# Altium schematic sheet РЕУН.468323.001_Encoder.SchDoc: =Name-1str
size 420 x 297 mm; SheetNumber: 4; Вид изделия: Документация; Раздел: Документация; Код документа: Э3; Вид документа: Схема электрическая принципиальная; Класс документа: Конструкторский документ; Создавать изделие в PLM: Yes; DocumentCode: РЕУН.468323.001 Э3 2D; DocumentView: Схема электрическая принципиальная; DocumentClass: Конструкторский документ; ProductView: Документация; Format: А3
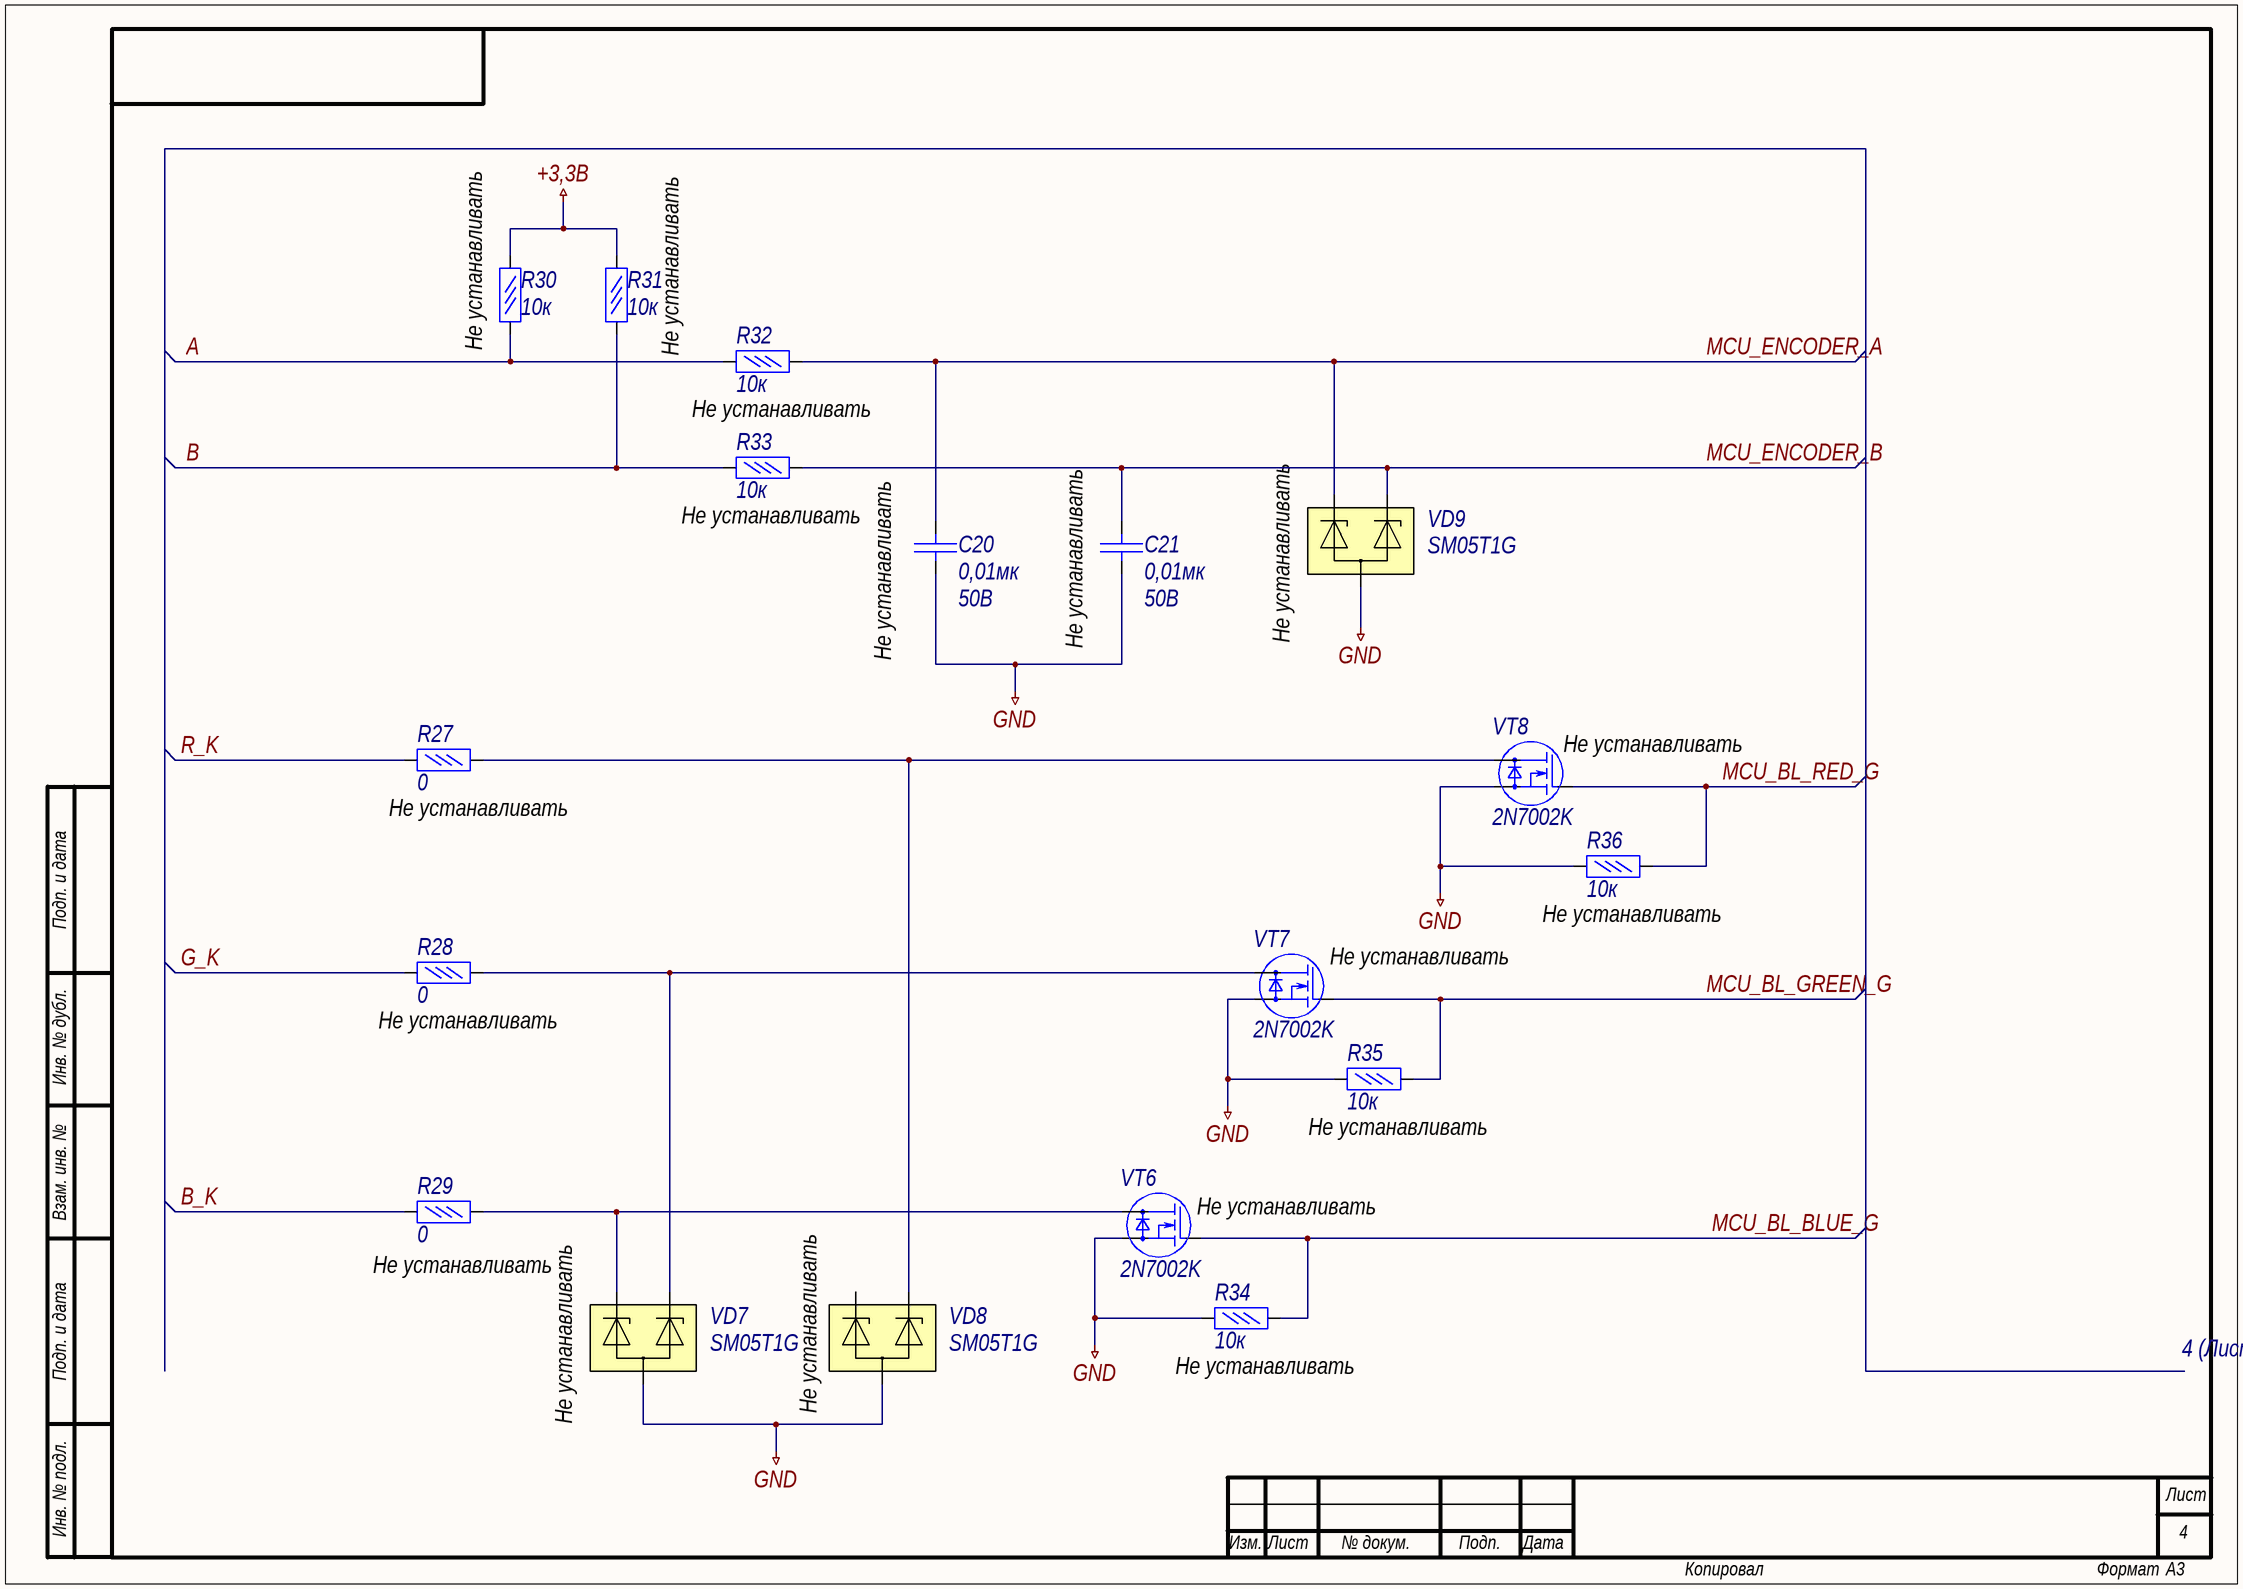
[diagram p0: РЕУН.468323.001_Encoder.SchDoc]

## Parts
C20  Voltage: 50В  [C0805_AA]  (hidden comment: 0,01мк)
C21  Voltage: 50В  [C0805_AA]  (hidden comment: 0,01мк)
R27  0  [R1206]
R28  0  [R1206]
R29  0  [R1206]
R30  10к  [R1206]
R31  10к  [R1206]
R32  10к  [R1206]
R33  10к  [R1206]
R34  10к  [R1206]
R35  10к  [R1206]
R36  10к  [R1206]
VD7  SM05T1G
VD8  SM05T1G
VD9  SM05T1G
VT6  2N7002K  [SOT23-3]
VT7  2N7002K  [SOT23-3]
VT8  2N7002K  [SOT23-3]

## Nets
+3,3В: R30.2 R31.2
GND: C20.1 C21.1 R34.1 R35.1 R36.1 VD7.3 VD8.3 VD9.3 VT6.2(S) VT7.2(S) VT8.2(S)
A: R30.1 R32.1
B: R31.1 R33.1
B_K: R29.1
G_K: R28.1
MCU_BL_BLUE_G: R34.2 VT6.1(G)
MCU_BL_GREEN_G: R35.2 VT7.1(G)
MCU_BL_RED_G: R36.2 VT8.1(G)
MCU_ENCODER_A: C20.2 R32.2 VD9.1
MCU_ENCODER_B: C21.2 R33.2 VD9.2
R_K: R27.1
NetR27_2: R27.2 VD8.2 VT8.3(D)
NetR28_2: R28.2 VD7.2 VT7.3(D)
NetR29_2: R29.2 VD7.1 VT6.3(D)

Not connected (* = marked no-connect by the designer): VD8 1

## Notes on the sheet
- (near R30) Не устанавливать
- Не устанавливать
- (near R33) Не устанавливать
- (near C20) Не устанавливать
- (near C21) Не устанавливать
- (near VD9) Не устанавливать
- (near VT8) Не устанавливать
- (near R27) Не устанавливать
- (near R36) Не устанавливать
- (near VT7) Не устанавливать
- (near R28) Не устанавливать
- (near R35) Не устанавливать
- (near VT6) Не устанавливать
- (near VD8) Не устанавливать
- (near R34) Не устанавливать
- 4 (Лист 1, 3, 5, 6, 7, 8, 9, 10, 11, 12)
- (near VD7) Не устанавливать
- Подп. и дата
- Инв. № дубл.
- Взам. инв. №
- Инв. № подл.
- Лист
- Изм.
- № докум.
- Подп.
- Дата
- Копировал
- Формат

## Library data of the parts
C20 C21 = Конденсатор кер.: Value: 0,01мк
R27-R36 = Резистор  0,05Вт: Резистор 0,05Вт; Power rating: 0,05Вт
  R27-R29: Value: 0
  R30-R36: Value: 10к
VD7-VD9 = ZenerArray2: Сборка TVS-диодов; Parameter 1: *
VT6-VT8 = mosfet-n: Name: 2N7002K